# Altium project BMS028B.PrjPcb (part 2 of 3)

## Sheet BMS028B_FETs.SchDoc: FETs
size 431 x 279 mm; Date: Not shown in title block; ApprovedBy: Not shown in title block; CheckedBy: Not shown in title block; Author: Not shown in title block; CompanyName: Not shown in title block; DrawnBy: M Sunna; Engineer: Not shown in title block; Organization: Not shown in title block; Address1: Not shown in title block; Address2: Not shown in title block; Address3: Not shown in title block; Address4: Not shown in title block; DocumentNumber: 3; Revision: Use project parameter SCH_Rev; SheetNumber: 3; SheetTotal: 5; PageSetup: Record=PageOptions|CenterHorizontal=True|CenterVertical=True|PrintScale=1.00|XCorrection=1.00|YCorrection=1.00|PrintKind=0|BorderSize=5000000|LeftOffset=0|BottomOffset=0|Orientation=2|PaperLength=1000|PaperWidth=1000|Scale=100|PaperSource=15|PrintQuality=600|MediaType=1|DitherType=10|PaperKind=Letter|PrintScaleMode=1; CurrentTime: Not shown in title block; CurrentDate: Not shown in title block; Time: Not shown in title block; DocumentFullPathAndName: Not shown in title block; DocumentName: Not shown in title block; ModifiedDate: Not shown in title block; ImagePath: Not shown in title block
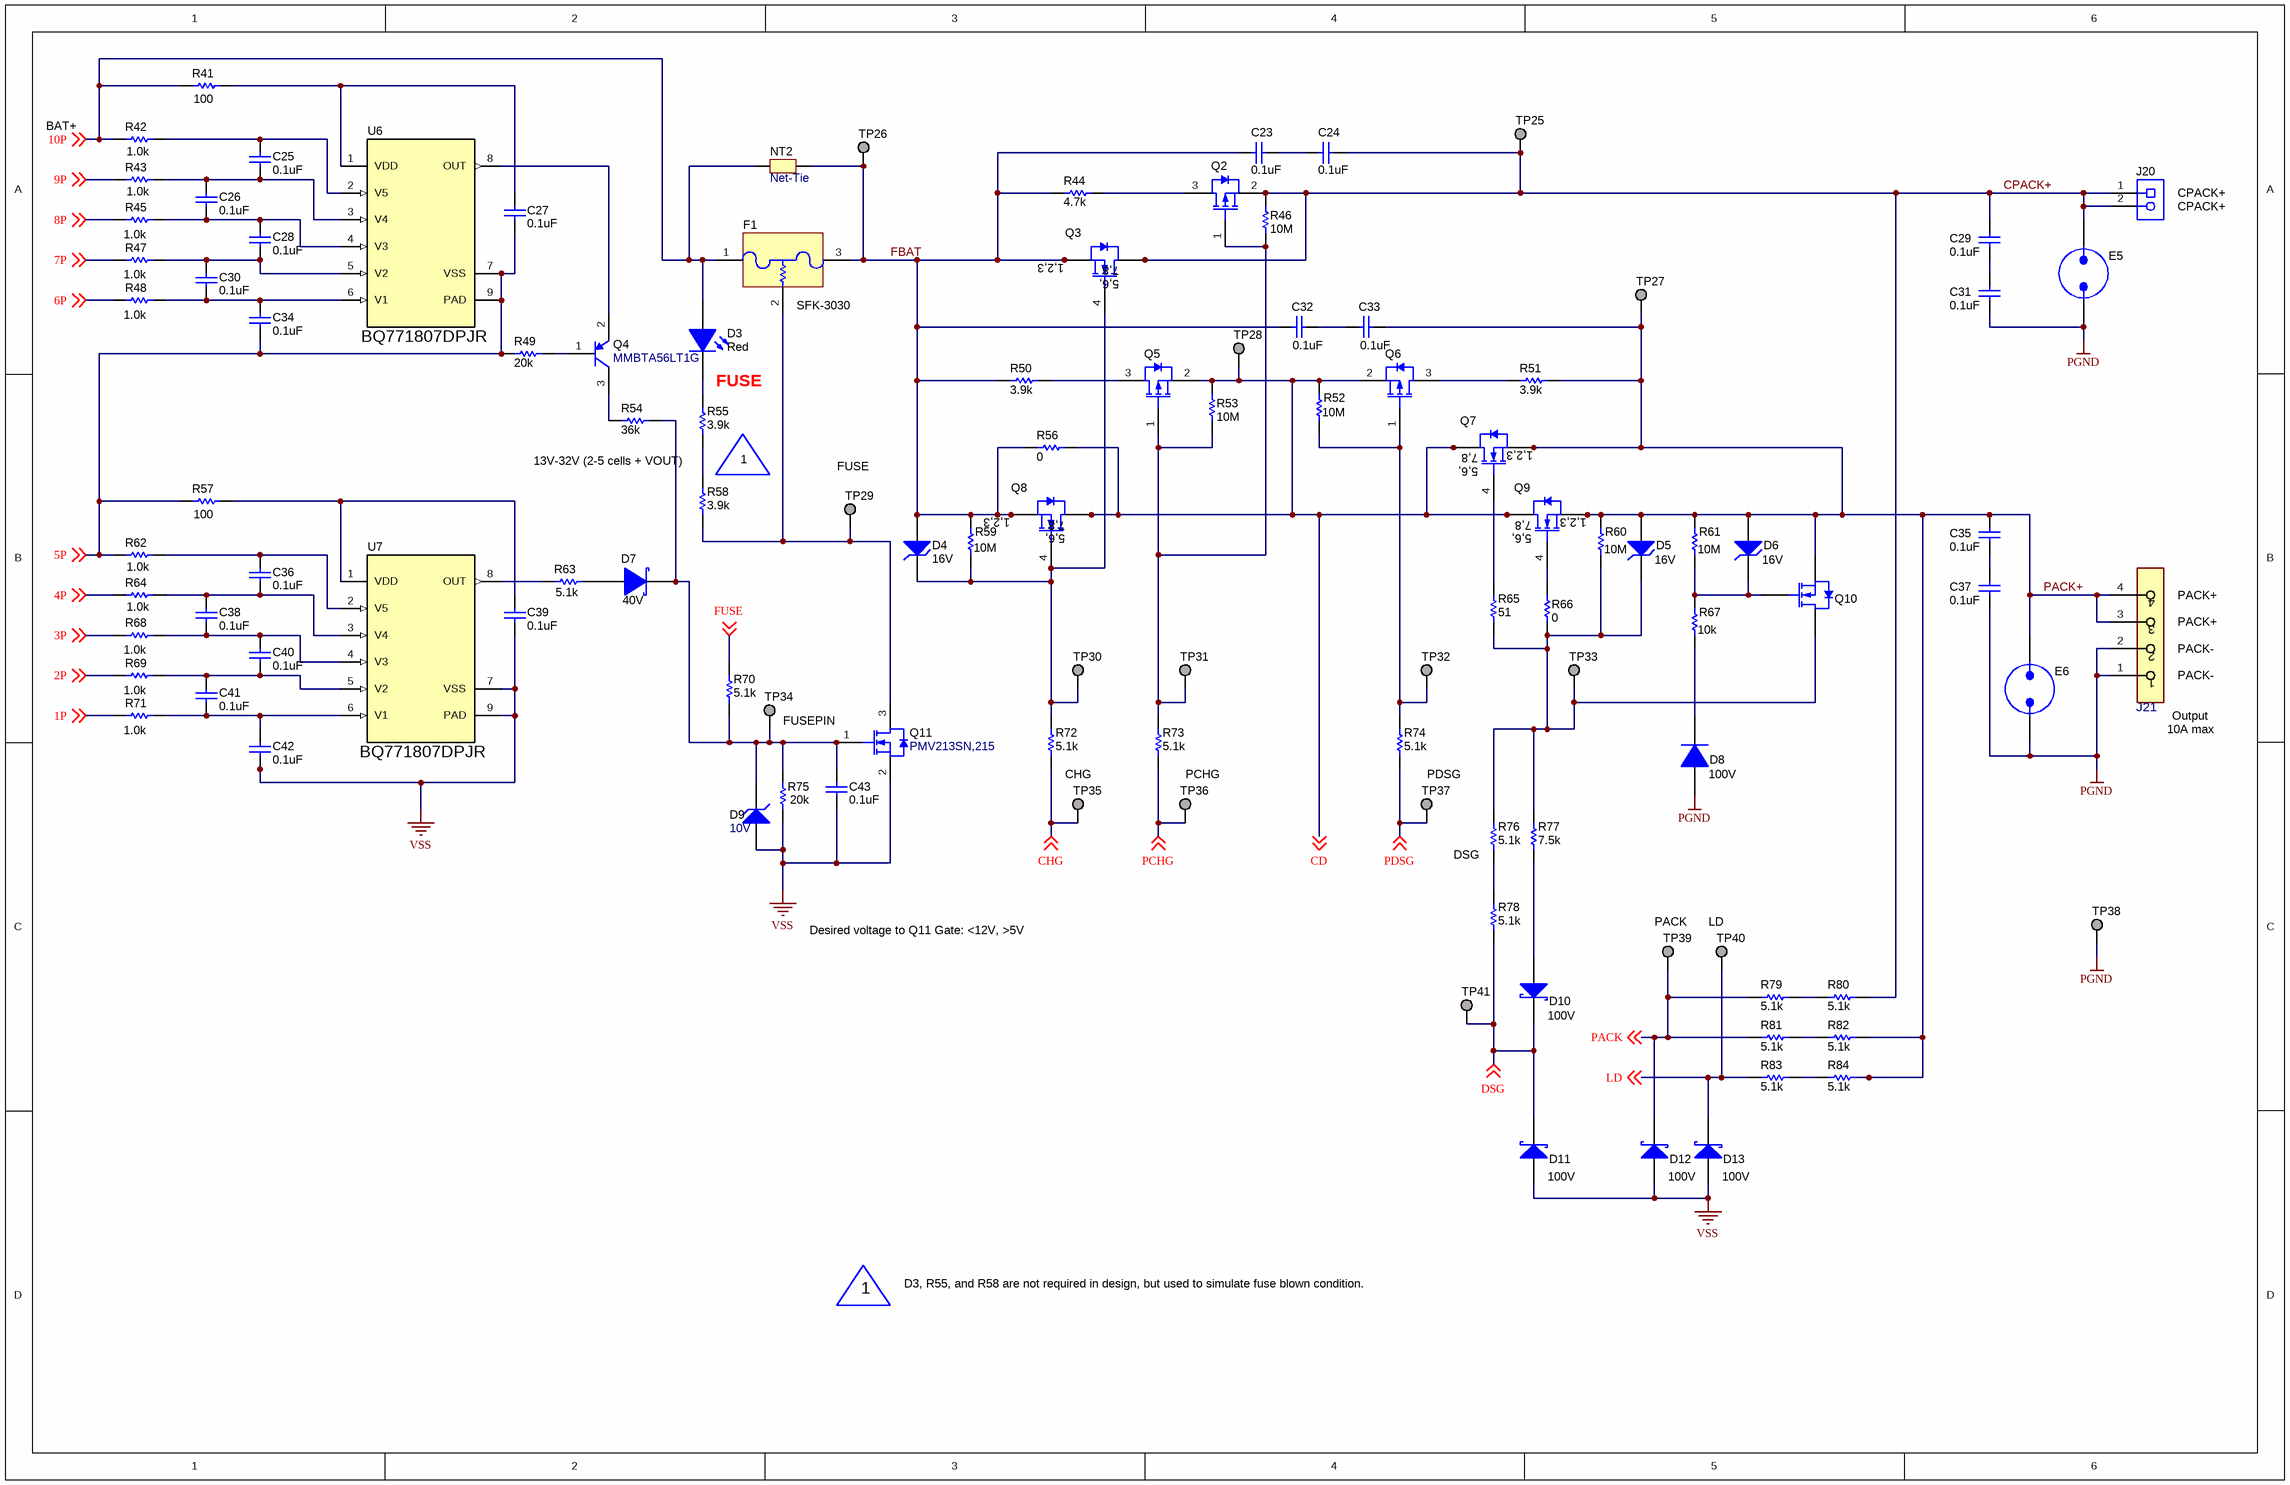
[diagram p2: BMS028B_FETs.SchDoc]

### Parts
C23  Cap_F: 0.1uF  [0603]  (hidden comment: GCJ188R72A104KA01D)
C24  Cap_F: 0.1uF  [0603]  (hidden comment: GCJ188R72A104KA01D)
C25  ValueDisplayed: 0.1uF  [0603]  (hidden comment: 885012206095)
C26  ValueDisplayed: 0.1uF  [0603]  (hidden comment: 885012206095)
C27  ValueDisplayed: 0.1uF  [0603]  (hidden comment: 885012206095)
C28  ValueDisplayed: 0.1uF  [0603]  (hidden comment: 885012206095)
C29  Cap_F: 0.1uF  [0603]  (hidden comment: GCJ188R72A104KA01D)
C30  ValueDisplayed: 0.1uF  [0603]  (hidden comment: 885012206095)
C31  Cap_F: 0.1uF  [0603]  (hidden comment: GCJ188R72A104KA01D)
C32  ValueDisplayed: 0.1uF  [0603]  (hidden comment: GCJ188R72A104KA01D)
C33  ValueDisplayed: 0.1uF  [0603]  (hidden comment: GCJ188R72A104KA01D)
C34  ValueDisplayed: 0.1uF  [0603]  (hidden comment: 885012206095)
C35  Cap_F: 0.1uF  [0603]  (hidden comment: GCJ188R72A104KA01D)
C36  ValueDisplayed: 0.1uF  [0603]  (hidden comment: 885012206095)
C37  Cap_F: 0.1uF  [0603]  (hidden comment: GCJ188R72A104KA01D)
C38  ValueDisplayed: 0.1uF  [0603]  (hidden comment: 885012206095)
C39  ValueDisplayed: 0.1uF  [0603]  (hidden comment: 885012206095)
C40  ValueDisplayed: 0.1uF  [0603]  (hidden comment: 885012206095)
C41  ValueDisplayed: 0.1uF  [0603]  (hidden comment: 885012206095)
C42  ValueDisplayed: 0.1uF  [0603]  (hidden comment: 885012206095)
C43  ValueDisplayed: 0.1uF  [0603]  (hidden comment: 885012206095)
D3  value Red  [WL-SMCW_RED]  (hidden comment: 150060RS75000)
D4  value 16V  [SOD-123]  (hidden comment: MMSZ5246B-7-F)
D5  value 16V  [SOD-123]  (hidden comment: MMSZ5246B-7-F)
D6  value 16V  [SOD-123]  (hidden comment: MMSZ5246B-7-F)
D7  value 40V  [SOT-323]  (hidden comment: BAS40W-7-F)
D8  value 100V  [SOD-123]  (hidden comment: 1N4148W-7-F)
D9  value 10V  [SOD-123]  (hidden comment: MMSZ4697T1G)
D10  Vr_V: 100V  [SOD-123]  (hidden comment: BAT46W-7-F)
D11  Vr_V: 100V  [SOD-123]  (hidden comment: BAT46W-7-F)
D12  Vr_V: 100V  [SOD-123]  (hidden comment: BAT46W-7-F)
D13  Vr_V: 100V  [SOD-123]  (hidden comment: BAT46W-7-F)
E5  Spark Gap  [SPARK_GAP2]  (value not drawn)  (no BOM)
E6  Spark Gap  [SPARK_GAP2]  (value not drawn)  (no BOM)
F1  SFK-3030  [FUSE_SFK-xx30x]
J20  ED555/2DS  [TERM_BLK_ED555-2DS]  (value not drawn)
J21  OSTTE040161  [FP-OSTTE040161_HDR4-MFG]  (value not drawn)
NT2  Net-Tie  [Net-Tie_50milWide_30milLong]  (net tie, no BOM)
Q2  ZXMP10A13FTA  [SOT-23]  (value not drawn)
Q3  CSD19534Q5A  [DQJ0008A]  (value not drawn)
Q4  MMBTA56LT1G  [SOT-23]
Q5  ZXMP10A13FTA  [SOT-23]  (value not drawn)
Q6  ZXMP10A13FTA  [SOT-23]  (value not drawn)
Q7  CSD19532Q5B  [DNK0008A]  (value not drawn)
Q8  CSD19532Q5B  [DNK0008A]  (value not drawn)
Q9  CSD19532Q5B  [DNK0008A]  (value not drawn)
Q10  MOSFET_N_D3G1S2  [SOT-323]  (value not drawn)
Q11  PMV213SN,215  [SOT-23]
R41  ValueDisplayed: 100  [0603]  (hidden comment: Resistor)
R42  ValueDisplayed: 1.0k  [0603]  (hidden comment: Resistor)
R43  ValueDisplayed: 1.0k  [0603]  (hidden comment: Resistor)
R44  ValueDisplayed: 4.7k  [2512]  (hidden comment: CRCW25124K70JNEG)
R45  ValueDisplayed: 1.0k  [0603]  (hidden comment: Resistor)
R46  ValueDisplayed: 10M  [0603]  (hidden comment: Resistor)
R47  ValueDisplayed: 1.0k  [0603]  (hidden comment: Resistor)
R48  ValueDisplayed: 1.0k  [0603]  (hidden comment: Resistor)
R49  ValueDisplayed: 20k  [0603]  (hidden comment: CRCW060320K0JNEA)
R50  ValueDisplayed: 3.9k  [2512]  (hidden comment: CRCW25123K90JNEG)
R51  ValueDisplayed: 3.9k  [2512]  (hidden comment: CRCW25123K90JNEG)
R52  ValueDisplayed: 10M  [0603]  (hidden comment: Resistor)
R53  ValueDisplayed: 10M  [0603]  (hidden comment: Resistor)
R54  ValueDisplayed: 36k  [0603]  (hidden comment: CRCW060336K0JNEA)
R55  ValueDisplayed: 3.9k  [1206]  (hidden comment: CRCW12063K90JNEA)
R56  ValueDisplayed: 0  [2512_WIDE_VISHAY]  (hidden comment: Resistor)
R57  ValueDisplayed: 100  [0603]  (hidden comment: Resistor)
R58  ValueDisplayed: 3.9k  [1206]  (hidden comment: CRCW12063K90JNEA)
R59  ValueDisplayed: 10M  [0603]  (hidden comment: Resistor)
R60  ValueDisplayed: 10M  [0603]  (hidden comment: Resistor)
R61  ValueDisplayed: 10M  [0603]  (hidden comment: Resistor)
R62  ValueDisplayed: 1.0k  [0603]  (hidden comment: Resistor)
R63  ValueDisplayed: 5.1k  [0603]  (hidden comment: Resistor)
R64  ValueDisplayed: 1.0k  [0603]  (hidden comment: Resistor)
R65  ValueDisplayed: 51  [0603]  (hidden comment: CRCW060351R0JNEA)
R66  ValueDisplayed: 0  [0603]  (hidden comment: CRCW06030000Z0EA)
R67  ValueDisplayed: 10k  [0603]  (hidden comment: Resistor)
R68  ValueDisplayed: 1.0k  [0603]  (hidden comment: Resistor)
R69  ValueDisplayed: 1.0k  [0603]  (hidden comment: Resistor)
R70  ValueDisplayed: 5.1k  [0603]  (hidden comment: Resistor)
R71  ValueDisplayed: 1.0k  [0603]  (hidden comment: Resistor)
R72  ValueDisplayed: 5.1k  [0603]  (hidden comment: CRCW06035K10JNEA)
R73  ValueDisplayed: 5.1k  [0603]  (hidden comment: CRCW06035K10JNEA)
R74  ValueDisplayed: 5.1k  [0603]  (hidden comment: CRCW06035K10JNEA)
R75  ValueDisplayed: 20k  [0603]  (hidden comment: Resistor)
R76  ValueDisplayed: 5.1k  [1206]  (hidden comment: CRCW12065K10JNEA)
R77  ValueDisplayed: 7.5k  [0603]  (hidden comment: CRCW06037K50JNEA)
R78  ValueDisplayed: 5.1k  [1206]  (hidden comment: CRCW12065K10JNEA)
R79  ValueDisplayed: 5.1k  [1206]  (hidden comment: CRCW12065K10JNEA)
R80  ValueDisplayed: 5.1k  [1206]  (hidden comment: CRCW12065K10JNEA)
R81  ValueDisplayed: 5.1k  [1206]  (hidden comment: CRCW12065K10JNEA)
R82  ValueDisplayed: 5.1k  [1206]  (hidden comment: CRCW12065K10JNEA)
R83  ValueDisplayed: 5.1k  [1206]  (hidden comment: CRCW12065K10JNEA)
R84  ValueDisplayed: 5.1k  [1206]  (hidden comment: CRCW12065K10JNEA)
TP25  TESTPOINT  [TP_VIA_060RND040]  (value not drawn)  (no BOM)
TP26  TESTPOINT  [TP_VIA_060RND040]  (value not drawn)  (no BOM)
TP27  TESTPOINT  [TP_VIA_060RND040]  (value not drawn)  (no BOM)
TP28  TESTPOINT  [TP_VIA_060RND040]  (value not drawn)  (no BOM)
TP29  TESTPOINT  [TP_VIA_060RND040]  (value not drawn)  (no BOM)
TP30  TESTPOINT  [TP_VIA_060RND040]  (value not drawn)  (no BOM)
TP31  TESTPOINT  [TP_VIA_060RND040]  (value not drawn)  (no BOM)
TP32  TESTPOINT  [TP_VIA_060RND040]  (value not drawn)  (no BOM)
TP33  TESTPOINT  [TP_VIA_060RND040]  (value not drawn)  (no BOM)
TP34  TESTPOINT  [TP_VIA_060RND040]  (value not drawn)  (no BOM)
TP35  TESTPOINT  [TP_VIA_060RND040]  (value not drawn)  (no BOM)
TP36  TESTPOINT  [TP_VIA_060RND040]  (value not drawn)  (no BOM)
TP37  TESTPOINT  [TP_VIA_060RND040]  (value not drawn)  (no BOM)
TP38  TESTPOINT  [TP_VIA_060RND040]  (value not drawn)  (no BOM)
TP39  TESTPOINT  [TP_VIA_060RND040]  (value not drawn)  (no BOM)
TP40  TESTPOINT  [TP_VIA_060RND040]  (value not drawn)  (no BOM)
TP41  TESTPOINT  [TP_VIA_060RND040]  (value not drawn)  (no BOM)
U6  BQ771807DPJR  [DPJ0008A]
U7  BQ771807DPJR  [DPJ0008A]

### Nets
PGND: C31.1 C37.1 D8.2(A) E5.2 E6.2 J21.1 J21.2 TP38.1
VSS: C39.1 C42.1 C43.1 D9.2(A) D11.2(A) D12.2(A) D13.2(A) Q11.2(S) R75.1 U7.7(VSS) U7.9(PAD)
1P: R71.1 ; off-sheet 1P
2P: R69.1 ; off-sheet 2P
3P: R68.1 ; off-sheet 3P
4P: R64.1 ; off-sheet 4P
5P: C27.1 C34.1 R49.1 R57.1 R62.1 U6.7(VSS) U6.9(PAD) ; off-sheet 5P
6P: R48.1 ; off-sheet 6P
7P: R47.1 ; off-sheet 7P
8P: R45.1 ; off-sheet 8P
9P: R43.1 ; off-sheet 9P
10P: D3.2(A) F1.1(Fuse) NT2.2 R41.1 R42.1 ; off-sheet 10P
CD: Q5.2(S) Q6.2(S) Q7.5(D) Q7.6(D) Q7.7(D) Q7.8(D) Q7.9(D) Q8.5(D) Q8.6(D) Q8.7(D) Q8.8(D) Q8.9(D) Q9.5(D) Q9.6(D) Q9.7(D) Q9.8(D) Q9.9(D) R52.1 R53.1 R56.2 TP28.1 ; off-sheet CD
CHG: R72.1 TP35.1 ; off-sheet CHG
CPACK+: C24.2 C29.2 E5.1 J20.1 J20.2 Q2.2(S) Q3.5(D) Q3.6(D) Q3.7(D) Q3.8(D) Q3.9(D) R46.1 R80.1 TP25.1
DSG: D10.1(K) D11.1(K) R78.1 TP41.1 ; off-sheet DSG
FBAT: C23.1 C32.2 D4.2(A) F1.3(Fuse) NT2.1 Q3.1(S) Q3.2(S) Q3.3(S) Q8.1(S) Q8.2(S) Q8.3(S) R44.1 R50.1 R56.1 R59.1 TP26.1
FUSE: R70.2 ; off-sheet FUSE
LD: D13.1(K) R83.2 TP40.1 ; off-sheet LD
PACK: D12.1(K) R79.2 R81.2 TP39.1 ; off-sheet PACK
PACK+: C33.1 C35.2 D5.2(A) D6.2(A) E6.1 J21.3 J21.4 Q7.1(S) Q7.2(S) Q7.3(S) Q9.1(S) Q9.2(S) Q9.3(S) Q10.2(S) R51.2 R60.1 R61.1 R82.1 R84.1 TP27.1
PCHG: R73.1 TP36.1 ; off-sheet PCHG
PDSG: R74.1 TP37.1 ; off-sheet PDSG
NetC23_2: C23.2 C24.1
NetC25_1: C25.1 C26.2 R43.2 U6.3(V4)
NetC25_2: C25.2 R42.2 U6.2(V5)
NetC26_1: C26.1 C28.2 R45.2 U6.4(V3)
NetC27_2: C27.2 R41.2 U6.1(VDD)
NetC28_1: C28.1 C30.2 R47.2 U6.5(V2)
NetC29_1: C29.1 C31.2
NetC30_1: C30.1 C34.2 R48.2 U6.6(V1)
NetC32_1: C32.1 C33.2
NetC35_1: C35.1 C37.2
NetC36_1: C36.1 C38.2 R64.2 U7.3(V4)
NetC36_2: C36.2 R62.2 U7.2(V5)
NetC38_1: C38.1 C40.2 R68.2 U7.4(V3)
NetC39_2: C39.2 R57.2 U7.1(VDD)
NetC40_1: C40.1 C41.2 R69.2 U7.5(V2)
NetC41_1: C41.1 C42.2 R71.2 U7.6(V1)
NetC43_2: C43.2 D7.3(K) D9.1(K) Q11.1(G) R54.2 R70.1 R75.2 TP34.1
NetD3_1: D3.1(K) R55.2
NetD4_1: D4.1(K) Q3.4(G) Q8.4(G) R59.2 R72.2 TP30.1
NetD5_1: D5.1(K) Q10.3(D) R60.2 R65.2 R66.2 R76.2 R77.2 TP33.1
NetD6_1: D6.1(K) Q10.1(G) R61.2 R67.1
NetD7_1: D7.1(A) R63.2
NetD8_1: D8.1(K) R67.2
NetD10_2: D10.2(A) R77.1
NetF1_2: F1.2(Heater) Q11.3(D) R58.1 TP29.1
NetQ2_1: Q2.1(G) Q5.1(G) R46.2 R53.2 R73.2 TP31.1
NetQ2_3: Q2.3(D) R44.2
NetQ4_1: Q4.1(B) R49.2
NetQ4_2: Q4.2(E) U6.8(OUT)
NetQ4_3: Q4.3(C) R54.1
NetQ5_3: Q5.3(D) R50.2
NetQ6_1: Q6.1(G) R52.2 R74.2 TP32.1
NetQ6_3: Q6.3(D) R51.1
NetQ7_4: Q7.4(G) R65.1
NetQ9_4: Q9.4(G) R66.1
NetR55_1: R55.1 R58.2
NetR63_1: R63.1 U7.8(OUT)
NetR76_1: R76.1 R78.2
NetR79_1: R79.1 R80.2
NetR81_1: R81.1 R82.2
NetR83_1: R83.1 R84.2

### Notes on the sheet
- BAT+
- (near J20) CPACK+
- FUSE
- 13V-32V (2-5 cells + VOUT)
- 1
- (near TP29) FUSE
- (near J21) PACK+
- (near J21) PACK-
- (near TP34) FUSEPIN
- (near J21) Output
- 10A max
- CHG
- PCHG
- PDSG
- (near R76) DSG
- Desired voltage to Q11 Gate: <12V, >5V
- (near TP39) PACK
- (near TP40) LD
- D3, R55, and R58 are not required in design, but used to simulate fuse blown condition.
- (in symbol CMP-0000958-3) 7,8; 1,2,3; 5,6,
- (in symbol CMP-0000962-2) 1,2,3; 7,8; 5,6,

### Library data of the parts
C23 C24 C29 C31 C35 C37 = CMP-0064935-4: CAP, CERM, 0.1 uF, 100 V,+/- 10%, X7R, AEC-Q200 Grade 1, 0603; Manufacturer: MuRata; Polarized: N; Value: 0.1uF; U/M: EA; Value1: Unknown; VDC_V: 100V; TaMin_C: -55°C; TaMax_C: 125°C; SizeArea_mm2: 1.28; SizeAreaWB_mm2: 4.68; SizeX_mm: 1.6; SizeY_mm: 0.8; SizeZ_mm: 1; AEC Category: Q200; AEC Qualified: Y; CompType: Capacitor; PartNumber: GCJ188R72A104KA01D; ValueDisplayed: 0.1uF; PackageReference: 0603; RoHS: Y; Tolerance_%: 10%; Value2: 100V; MountType: SMT; Technology: Ceramic; TempCo: X7R; Cap_Case: 0603; Published: 2008-06-19; Publisher: Texas Instruments; LatestRevisionDate: 2017-06-05; ComponentLink1Description: Datasheet link; ComponentLink1URL: http://search.murata.co.jp/Ceramy/image/img/A01X/G101/ENG/GCJ188R72A104KA01-01.pdf; Supplier 1: Digi-Key; Supplier Part Number 1: 490-13420-1-ND; Supplier 2: Mouser; Supplier Part Number 2: 81-GCJ188R72A104KA1D; AEC Grade: 1
C25-C28 C30 C34 C36 C38-C43 = CMP-0006837-4: CAP, CERM, 0.1 uF, 50 V, +/- 10%, X7R, 0603; Manufacturer: Wurth Elektronik; Polarized: N; Value: 0.1uF; U/M: EA; Cap_F: 100nF; Value1: Unknown; VDC_V: 50V; TaMin_C: -55°C; TaMax_C: 125°C; SizeArea_mm2: 1.28; SizeAreaWB_mm2: 4.68; SizeX_mm: 1.6; SizeY_mm: 0.8; SizeZ_mm: 1; AEC Category: Q200; CompType: Capacitor; PartNumber: 885012206095; PackageReference: 0603; RoHS: Y; Tolerance_%: 10%; Value2: 50V; MountType: SMT; Technology: Ceramic; TempCo: X7R; Cap_Case: 0603; Published: 2008-06-19; Publisher: Texas Instruments; LatestRevisionDate: 2017-03-09; ComponentLink1Description: Datasheet link; ComponentLink1URL: http://katalog.we-online.de/pbs/datasheet/885012206095.pdf; AEC Qualified: N; AEC Grade: N/A
C32 C33 = CMP-0064935-4: CAP, CERM, 0.1 uF, 100 V,+/- 10%, X7R, AEC-Q200 Grade 1, 0603; Manufacturer: MuRata; TaMin_C: -55°C; Polarized: N; SizeAreaWB_mm2: 4.68; Value1: Unknown; U/M: EA; Value: 0.1uF; TaMax_C: 125°C; SizeZ_mm: 1; SizeX_mm: 1.6; SizeY_mm: 0.8; Value2: 100V; SizeArea_mm2: 1.28; AEC Qualified: Y; Cap_F: 100nF; AEC Category: Q200; Supplier Part Number 2: 81-GCJ188R72A104KA1D; Publisher: Texas Instruments; Supplier 2: Mouser; TempCo: X7R; Published: 2008-06-19; RoHS: Y; MountType: SMT; Supplier 1: Digi-Key; PackageReference: 0603; Tolerance_%: 10%; Cap_Case: 0603; CompType: Capacitor; LatestRevisionDate: 2017-06-05; PartNumber: GCJ188R72A104KA01D; VDC_V: 100V; ComponentLink1Description: Datasheet link; AEC Grade: 1; Supplier Part Number 1: 490-13420-1-ND; Technology: Ceramic; ComponentLink1URL: http://search.murata.co.jp/Ceramy/image/img/A01X/G101/ENG/GCJ188R72A104KA01-01.pdf
D3 = CMP-0002947-3: LED, Red, SMD; Manufacturer: Wurth Elektronik; Type: AlInGaP; Vf_V: 2V; Io_A: 30mA; Vr_V: 5V; Tjmax_C: 85°C; Power_TotalModule: 72mW; Value1: 0.072W; Angle: 140; CompType: LED; PartNumber: 150060RS75000; MountType: SMT; RoHS: Y; PackageReference: LED_0603; Value2: 2V; Color: Red; ComponentLink1URL: http://katalog.we-online.de/led/datasheet/150060RS75000.pdf; ComponentLink1Description: Datasheet link
D4 = CMP-0005754-4: Diode, Zener, 16 V, 500 mW, SOD-123; Manufacturer: Diodes Inc.; Power_W: 500mW; SizeAreaWB_mm2: 13.095; Value1: 0.5W; RJA_CperW: 350; SizeZ_mm: 1.35; SizeX_mm: 3.85; SizeY_mm: 1.7; SizeArea_mm2: 6.545; AEC Category: Q101; Vz_V: 16V; RoHS: Y; MountType: SMT; PackageReference: SOD-123; CompType: Zener; PartNumber: MMSZ5246B-7-F; AEC Qualified: ?; ComponentLink1Description: Datasheet link; ComponentLink1URL: http://www.diodes.com/datasheets/ds18010.pdf
D5 D6 = CMP-0005754-4: Diode, Zener, 16 V, 500 mW, SOD-123; Manufacturer: Diodes Inc.; Power_W: 500mW; SizeY_mm: 1.7; Value1: 0.5W; SizeX_mm: 3.85; RJA_CperW: 350; SizeAreaWB_mm2: 13.095; SizeArea_mm2: 6.545; AEC Category: Q101; SizeZ_mm: 1.35; MountType: SMT; Vz_V: 16V; PackageReference: SOD-123; PartNumber: MMSZ5246B-7-F; AEC Qualified: ?; CompType: Zener; ComponentLink1Description: Datasheet link; RoHS: Y; ComponentLink1URL: http://www.diodes.com/datasheets/ds18010.pdf
D7 = CMP-0028438-2: Diode, Schottky, 40 V, 0.2 A, SOT-323; Manufacturer: Diodes Inc.; Value2: 0.9V; SizeArea_mm2: 4.84; Vf_V: 9dV; Value1: 0.2A; Green_Lifecycle: Not Set; SizeAreaWB_mm2: 10.24; SizeX_mm: 2.2; AEC Category: Q101; Io_A: 2dA; Green_REACh: Incomplete; SizeZ_mm: 1.1; Green_EU RoHS-2: Incomplete; PartNumber: BAS40W-7-F; RoHS: Y; CompType: Diode; ComponentLink1Description: Datasheet link; Green_EU RoHS: Incomplete; Vr_V: 40V; MountType: SMT; SizeY_mm: 2.2; Type: Schottky; ComponentLink1URL: http://www.diodes.com/datasheets/ds30114.pdf; PackageReference: SOT-323; AEC Qualified: ?
D8 = CMP-0029001-2: Diode, Ultrafast, 100 V, 0.15 A, SOD-123; Manufacturer: Diodes Inc.; Vf_V: 1.25V; Value1: 0.15A; Io_A: 1.5dA; TJmax_C: 150°C; SizeAreaWB_mm2: 13.095; SizeArea_mm2: 6.545; SizeX_mm: 3.85; SizeY_mm: 1.7; SizeZ_mm: 1.35; AEC Category: Q101; Green_Lifecycle: Active; Green_REACh: Passed; PartNumber: 1N4148W-7-F; PackageReference: SOD-123; CompType: Diode; Value2: 1.25V; Vr_V: 100V; MountType: SMT; Type: Ultrafast; RoHS: Y; ComponentLink1Description: Datasheet link; ComponentLink1URL: http://www.diodes.com/datasheets/ds30086.pdf; AEC Qualified: ?; Green_EU RoHS: Passed; Green_EU RoHS-2: Passed
D9 = CMP-0005740-3: Diode, Zener, 10 V, 500 mW, SOD-123; Manufacturer: ON Semiconductor; SizeY_mm: 1.7; SizeX_mm: 3.85; RJA_CperW: 340; SizeAreaWB_mm2: 13.095; AEC Category: Q101; Power_W: 500mW; SizeZ_mm: 1.35; Value1: 0.5W; SizeArea_mm2: 6.545; PackageReference: SOD-123; AEC Qualified: ?; MountType: SMT; RoHS: Y; ComponentLink1Description: Datasheet link; PartNumber: MMSZ4697T1G; CompType: Zener; ComponentLink1URL: http://www.onsemi.com/pub_link/Collateral/MMSZ4678T1-D.PDF; Vz_V: 10V
D10-D13 = CMP-0028450-2: Diode, Schottky, 100 V, 0.15 A, SOD-123; Manufacturer: Diodes Inc.; Value: 100V; Io_A: 150mA; SizeArea_mm2: 6.545; SizeX_mm: 3.85; Value2: 0.6V; Value1: 0.15A; AEC Category: Q101; SizeZ_mm: 1.35; SizeY_mm: 1.7; Green_Lifecycle: Active; Green_REACh: Passed; SizeAreaWB_mm2: 13.095; Vf_V: 600mV; ComponentLink1Description: Datasheet link; MountType: SMT; ComponentLink1URL: http://www.diodes.com/datasheets/ds30044.pdf; PartNumber: BAT46W-7-F; Type: Schottky; AEC Qualified: ?; Green_EU RoHS-2: Passed; Green_EU RoHS: Passed; CompType: Diode; RoHS: Y; PackageReference: SOD-123
E5 E6 = CMP-0079939-1: CompType: Spark Gap
F1 = CMP-0078325-2: Fuse, 30 A, 62 VDC, SMD; Manufacturer: Dexerials Corporation; Irating_A: 30A; VDC_V: 62V; Rtyp_Ohm: 1.75m; PartNumber: SFK-3030; PackageReference: 9.5x2x5mm; CompType: Fuse; ComponentLink1Description: Datasheet URL; MountType: SMT; ComponentLink1URL: https://sps16.itg.ti.com/sites/KMS/crossdivteams/altium/docs/ComponentDatasheets/Dexerials_SFK-xx30x.pdf; RoHS: Y
J20 = CMP-0074913-1: Terminal Block, 3.5mm Pitch, 2x1, TH; Manufacturer: On-Shore Technology; Cert_VDE: Y; CNHeader: False; Current_A: 6A; Green_Lifecycle: Active; Shrouded: N; Gender: Female; Green_REACh: Passed; Voltage_V: 150V; Row_Count: 1; Pitch_mm: 3.5; ContactFinish: Brass; CT: True; ComponentLink1URL: http://on-shore.com/sites/default/files/manuals/ed555ds.pdf; Publisher: Texas Instruments; Color: Grey; Cert_CULUS: Y; RoHS: Y; MountType: TH; Green_EU RoHS-2: Passed; Supplier 1: Digi-Key; Green_EU RoHS: Passed with Exemption; PackageReference: 7.0x8.2x6.5mm; PinCount: 2; CompType: Terminal Block; LatestRevisionDate: 2017-07-12; PartNumber: ED555/2DS; ComponentLink1Description: Datasheet URL; Supplier Part Number 1: ED1514-ND
J21 = CMP-0087048-1: TERM BLOCK 3.5MM VERT 4POS PCB; Manufacturer: On Shore Technology; Row_Count: 1; Current_A: 10A; ContactFinish: Tin; Voltage_V: 300V; PinCount: 4; Symbol Name: SYM-OSTTE040161; PartNumber: OSTTE040161; PackageReference: HDR4; ComponentLink1URL: http://www.on-shore.com/wp-content/uploads/2019/02/OSTTEXX0161.pdf; ComponentLink1Description: Datasheet; RoHS: TRUE
NT2 = CMP-0078142-3: Single point connection between nets.; MountType: SMT; PackageReference: N/A; CompType: Net-Tie; Library Reference: Net-Tie; Manufacturer: N/A; PartNumber: N/A
Q2 Q5 Q6 = CMP-0000158-3: MOSFET, P-CH, -100 V, -0.6 A, SOT-23; Manufacturer: Diodes Inc.; Alternate Manufacturer: None; Rdson45_ohm: 1; ChType: P; Value: -100V; Vgs_V: -4V; QgTyp_nC: 3.5; SizeY_mm: 3; SizeArea_mm2: 7.5; IdsMax_A: -600mA; ChMode: Enhancement; SizeZ_mm: 1.1; SizeX_mm: 2.5; Value2: 3.5 nC; SizeAreaWB_mm2: 14; AEC Category: Q101; PartNumber: ZXMP10A13FTA; VdsMax_V: -100V; PackageReference: SOT-23; ComponentLink1Description: Datasheet link; CompType: MOSFET; RoHS: Y; MountType: SMT; ComponentLink1URL: http://www.diodes.com/datasheets/ZXMP10A13F.pdf; AEC Qualified: ?
Q3 = CMP-0000962-2: MOSFET, N-CH, 100 V, 10 A, DQJ0008A (VSONP-8); Alternate Manufacturer: None; Manufacturer: Texas Instruments; SizeZ_mm: 1.1; ChType: N; Value2: 17 nC; VdsMax_V: 100V; SizeX_mm: 6; SizeAreaWB_mm2: 55.2; SizeY_mm: 4.9; Vgs_V: 20V; QgTyp_nC: 17; Value: 100V; SizeArea_mm2: 29.4; AEC Category: Q101; IdsMax_A: 10A; U/M: EA; PartNumber: CSD19534Q5A; ComponentLink1Description: Datasheet link; CompType: MOSFET; LatestRevisionNote: Added parts.; Publisher: Texas Instruments; AEC Qualified: N; Published: 2008-06-19; RoHS: Y; LatestRevisionDate: 2017-03-09; PackageReference: DQJ0008A; MountType: SMT; ComponentLink1URL: http://www.ti.com/lit/ds/symlink/csd19534q5a.pdf
Q4 = CMP-0000338-2: Transistor, PNP, 80 V, 0.5 A, SOT-23; Manufacturer: ON Semiconductor; TaMax_C: 150°C; Value1: 0.5 A; Vcesat1_V: 250mV; SizeX_mm: 2.5; SizeY_mm: 3; TaMin_C: -55°C; IcRated_A: 500mA; CompType: BJT; SizeZ_mm: 1.1; Value: 80 V; SizeArea_mm2: 7.5; NPN: 0; Vceo_V: 80V; PNP: 1; AEC Category: Q101; SizeAreaWB_mm2: 14; U/M: EA; Supplier 2: Newark; Supplier 3: Farnell; Supplier 1: Digi-Key; Supplier Part Number 1: MMBTA56LT1GOSDKR-ND; Supplier Part Number 2: 88H4784; Supplier Part Number 3: 2393622; PartNumber: MMBTA56LT1G; LatestRevisionDate: 2017-03-09; Publisher: Texas Instruments; AEC Qualified: ?; ComponentLink1Description: Datasheet link; Published: 2008-07-31; RoHS: Y; PackageReference: SOT-23; MountType: SMT; ComponentLink1URL: http://www.onsemi.com/pub_link/Collateral/MMBTA55LT1-D.PDF
Q7-Q9 = CMP-0000958-3: MOSFET, N-CH, 100 V, 17 A, DNK0008A (VSON-CLIP-8); Alternate Manufacturer: None; Manufacturer: Texas Instruments; SizeZ_mm: 1; ChType: N; Value2: 48 nC; VdsMax_V: 100V; SizeX_mm: 6; SizeY_mm: 5; Vgs_V: 20V; QgTyp_nC: 48; Value: 100V; SizeArea_mm2: 30; AEC Category: Q101; IdsMax_A: 17A; SizeAreaWB_mm2: 56; U/M: EA; Supplier 2: Farnell; Supplier 1: Digi-Key; Supplier Part Number 1: 296-37478-6-ND; Supplier Part Number 2: 2413268; PartNumber: CSD19532Q5B; ComponentLink1Description: Datasheet link; CompType: MOSFET; AEC Qualified: N; RoHS: Y; PackageReference: DNK0008A; MountType: SMT; ComponentLink1URL: http://www.ti.com/lit/ds/symlink/csd19532q5b.pdf
Q10 = CMP-0000774-1: MOSFET, N-CH, 60 V, 0.31 A, SOT-323; PartNumber: 2N7002KW; Manufacturer: Fairchild Semiconductor; Alternate Manufacturer: None; Value: 60V; U/M: EA; ChType: N; Value1: 1; Rdson45_ohm: 1.6; Vgs_V: 2.1V; IdsMax_A: 3.1dA; SizeAreaWB_mm2: 10.24; SizeArea_mm2: 4.84; SizeX_mm: 2.2; SizeZ_mm: 1.1; AEC Category: Q101; Green_Lifecycle: Active; Green_REACh: Passed; SymbolVersion: 2008-07-28; CompType: MOSFET; PackageReference: SOT-323; VdsMax_V: 60V; RoHS: Y; MountType: SMT; Published: 2008-06-19; Publisher: Texas Instruments; LatestRevisionDate: 2017-03-09; LatestRevisionNote: Added parts.; ComponentLink1Description: Datasheet link; ComponentLink1URL: http://www.fairchildsemi.com/ds/2N/2N7002KW.pdf; Supplier 1: Digi-Key; Supplier Part Number 1: 2N7002KWCT-ND; Supplier 2: Mouser; Supplier Part Number 2: 512-2N7002KW; SizeY_mm: 2.2; AEC Qualified: ?; Green_EU RoHS: Passed; Green_EU RoHS-2: Passed
Q11 = CMP-0001015-3: MOSFET, N-CH, 100 V, 1.9 A, SOT-23; Alternate Manufacturer: None; Manufacturer: Nexperia; SizeZ_mm: 1.1; ChType: N; Value2: 7 nC; VdsMax_V: 100V; SizeX_mm: 2.5; SizeY_mm: 3; Vgs_V: 30V; QgTyp_nC: 7; Value: 100V; SizeArea_mm2: 7.5; AEC Category: Q101; IdsMax_A: 1.9A; SizeAreaWB_mm2: 14; Supplier 2: Mouser; Supplier 1: Digi-Key; Supplier Part Number 1: 568-8112-1-ND; Supplier Part Number 2: 771-PMV213SN215; PartNumber: PMV213SN,215; ComponentLink1Description: Datasheet link; CompType: MOSFET; AEC Qualified: N; RoHS: Y; PackageReference: SOT-23; MountType: SMT; ComponentLink1URL: http://www.nexperia.com/documents/data_sheet/PMV213SN.pdf
R41 R57 = CMP-0025700-4: RES, 100, 5%, 0.1 W, AEC-Q200 Grade 0, 0603; PartNumber: CRCW0603100RJNEA; Manufacturer: Vishay-Dale; Value: 100; Value_Code: 100R; Power_W: 100mW; Value2: 0.1W; VDC_V: 75V; TempCo: 200 ppm/C; EIA_Code: E24; U/M: EA; SizeArea_mm2: 1.28; SizeX_mm: 1.6; SizeY_mm: 0.8; SizeZ_mm: 1; AEC Category: Q200; AEC Qualified: Y; AEC Grade: 0; CompType: Resistor; SymbolVersion: 2009-05-29; PackageReference: 0603; RoHS: E; Res_ohm: 100; Tolerance_%: 5%; Value1: 5%; MountType: SMT; Technology: Thick Film; Published: 2008-06-26; Publisher: Texas Instruments; LatestRevisionDate: 2017-06-13; ComponentLink1Description: Datasheet link; ComponentLink1URL: http://www.vishay.com/docs/20035/dcrcwe3.pdf; Supplier 1: Digi-Key; Supplier Part Number 1: 541-100GCT-ND; Supplier 2: Newark; Supplier Part Number 2: 59M6764; Supplier 3: Mouser; Supplier Part Number 3: 71-CRCW0603J-100-E3
R42 R43 R45 R47 R48 R62 R64 R68 R69 R71 = CMP-0025729-4: RES, 1.0 k, 5%, 0.1 W, AEC-Q200 Grade 0, 0603; PartNumber: CRCW06031K00JNEA; Manufacturer: Vishay-Dale; Value: 1.0k; Res_ohm: 1k; Value_Code: 1k00; Power_W: 100mW; Value2: 0.1W; VDC_V: 75V; TempCo: 200 ppm/C; EIA_Code: E24; U/M: EA; SizeArea_mm2: 1.28; SizeX_mm: 1.6; SizeY_mm: 0.8; SizeZ_mm: 1; AEC Category: Q200; AEC Qualified: Y; AEC Grade: 0; CompType: Resistor; SymbolVersion: 2009-05-29; PackageReference: 0603; RoHS: E; Tolerance_%: 5%; Value1: 5%; MountType: SMT; Technology: Thick Film; Published: 2008-06-26; Publisher: Texas Instruments; LatestRevisionDate: 2017-06-13; ComponentLink1Description: Datasheet link; ComponentLink1URL: http://www.vishay.com/docs/20035/dcrcwe3.pdf; Supplier 1: Digi-Key; Supplier Part Number 1: 541-1.0KGCT-ND; Supplier 2: Newark; Supplier Part Number 2: 59M6750; Supplier 3: Mouser; Supplier Part Number 3: 71-CRCW0603J-1.0K-E3
R44 = CMP-0015972-3: RES, 4.7 k, 5%, 1 W, AEC-Q200 Grade 0, 2512; Manufacturer: Vishay-Dale; Power_W: 1W; TempCo: 200 ppm/C; Value_Code: 4k70; Value: 4.7k; EIA_Code: E24; SizeX_mm: 6.3; SizeY_mm: 3.2; SizeZ_mm: 0.71; SizeArea_mm2: 20.16; AEC Qualified: Y; VDC_V: 500V; AEC Grade: 0; AEC Category: Q200; RoHS: E; Value1: 5%; MountType: SMT; Supplier 1: Digi-Key; PackageReference: 2512; Tolerance_%: 5%; Res_ohm: 4.7k; Value2: 1W; CompType: Resistor; PartNumber: CRCW25124K70JNEG; ComponentLink1Description: Datasheet link; Supplier Part Number 1: 541-4.7KXCT-ND; Technology: Thick Film; ComponentLink1URL: http://www.vishay.com/docs/20035/dcrcwe3.pdf
R46 R52 R53 R59-R61 = CMP-0025702-4: RES, 10 M, 5%, 0.1 W, AEC-Q200 Grade 0, 0603; PartNumber: CRCW060310M0JNEA; Manufacturer: Vishay-Dale; Value: 10Meg; Value_Code: 10M0; Power_W: 100mW; Value2: 0.1W; VDC_V: 75V; TempCo: 200 ppm/C; EIA_Code: E24; U/M: EA; SizeArea_mm2: 1.28; SizeX_mm: 1.6; SizeY_mm: 0.8; SizeZ_mm: 1; AEC Category: Q200; AEC Qualified: Y; AEC Grade: 0; CompType: Resistor; SymbolVersion: 2009-05-29; PackageReference: 0603; RoHS: E; Res_ohm: 10M; Tolerance_%: 5%; Value1: 5%; MountType: SMT; Technology: Thick Film; Published: 2008-06-26; Publisher: Texas Instruments; LatestRevisionDate: 2017-06-13; ComponentLink1Description: Datasheet link; ComponentLink1URL: http://www.vishay.com/docs/20035/dcrcwe3.pdf; Supplier 1: Digi-Key; Supplier Part Number 1: 541-10MGCT-ND; Supplier 2: Newark; Supplier Part Number 2: 59M6761; Supplier 3: Mouser; Supplier Part Number 3: 71-CRCW0603J-10M-E3
R49 = CMP-0025753-4: RES, 20 k, 5%, 0.1 W, AEC-Q200 Grade 0, 0603; Manufacturer: Vishay-Dale; Value: 20k; Value_Code: 20k0; Power_W: 100mW; Value2: 0.1W; VDC_V: 75V; TempCo: 200 ppm/C; EIA_Code: E24; SizeArea_mm2: 1.28; SizeX_mm: 1.6; SizeY_mm: 0.8; SizeZ_mm: 1; AEC Category: Q200; AEC Qualified: Y; AEC Grade: 0; CompType: Resistor; PartNumber: CRCW060320K0JNEA; PackageReference: 0603; RoHS: E; Res_ohm: 20k; Tolerance_%: 5%; Value1: 5%; MountType: SMT; Technology: Thick Film; ComponentLink1Description: Datasheet link; ComponentLink1URL: http://www.vishay.com/docs/20035/dcrcwe3.pdf; Supplier 1: Digi-Key; Supplier Part Number 1: 541-20KGCT-ND; Supplier 2: Newark; Supplier Part Number 2: 59M6783; Supplier 3: Mouser; Supplier Part Number 3: 71-CRCW0603J-20K-E3
R50 R51 = CMP-0015958-3: RES, 3.9 k, 5%, 1 W, AEC-Q200 Grade 0, 2512; Manufacturer: Vishay-Dale; Power_W: 1W; TempCo: 200 ppm/C; Value_Code: 3k90; Value: 3.9k; EIA_Code: E24; SizeX_mm: 6.3; SizeY_mm: 3.2; SizeZ_mm: 0.71; SizeArea_mm2: 20.16; AEC Qualified: Y; VDC_V: 500V; AEC Grade: 0; AEC Category: Q200; RoHS: E; Value1: 5%; MountType: SMT; Supplier 1: Digi-Key; PackageReference: 2512; Tolerance_%: 5%; Res_ohm: 3.9k; Value2: 1W; CompType: Resistor; PartNumber: CRCW25123K90JNEG; ComponentLink1Description: Datasheet link; Supplier Part Number 1: 541-3.9KXCT-ND; Technology: Thick Film; ComponentLink1URL: http://www.vishay.com/docs/20035/dcrcwe3.pdf
R54 = CMP-0025790-4: RES, 36 k, 5%, 0.1 W, AEC-Q200 Grade 0, 0603; Manufacturer: Vishay-Dale; Power_W: 100mW; TempCo: 200 ppm/C; Value_Code: 36k0; Value: 36k; EIA_Code: E24; SizeX_mm: 1.6; SizeY_mm: 0.8; SizeZ_mm: 1; Value2: 0.1W; SizeArea_mm2: 1.28; AEC Qualified: Y; VDC_V: 75V; AEC Category: Q200; AEC Grade: 0; Supplier Part Number 2: 59M6806; Supplier 2: Newark; Supplier Part Number 3: 71-CRCW0603J-36K-E3; Supplier 3: Mouser; RoHS: E; Value1: 5%; MountType: SMT; Supplier 1: Digi-Key; PackageReference: 0603; Tolerance_%: 5%; Res_ohm: 36k; PartNumber: CRCW060336K0JNEA; ComponentLink1Description: Datasheet link; Supplier Part Number 1: 541-36KGCT-ND; Technology: Thick Film; CompType: Resistor; ComponentLink1URL: http://www.vishay.com/docs/20035/dcrcwe3.pdf
R55 R58 = CMP-0018671-3: RES, 3.9 k, 5%, 0.25 W, AEC-Q200 Grade 0, 1206; Manufacturer: Vishay-Dale; Power_W: 250mW; TempCo: 200 ppm/C; Value_Code: 3k90; Value: 3.9k; EIA_Code: E24; SizeX_mm: 3.2; SizeY_mm: 1.6; SizeZ_mm: 1.35; Value2: 0.25W; SizeArea_mm2: 5.12; AEC Qualified: Y; VDC_V: 200V; AEC Category: Q200; AEC Grade: 0; Supplier Part Number 2: 89M6870; Supplier 2: Newark; Supplier Part Number 3: 71-CRCW1206J-3.9K-E3; Supplier 3: Mouser; RoHS: E; Value1: 5%; MountType: SMT; Supplier 1: Digi-Key; PackageReference: 1206; Tolerance_%: 5%; Res_ohm: 3.9k; CompType: Resistor; PartNumber: CRCW12063K90JNEA; ComponentLink1Description: Datasheet link; Supplier Part Number 1: 541-3.9KECT-ND; Technology: Thick Film; ComponentLink1URL: http://www.vishay.com/docs/20035/dcrcwe3.pdf
R56 = CMP-0015368-2: RES, 0, 5%, 2 W, 2512 WIDE; PartNumber: RCL12250000Z0EG; Manufacturer: Vishay Draloric; Value: 0; Value_Code: 0000; Power_W: 2W; TempCo: ppm/C; EIA_Code: E24; U/M: EA; AEC Category: Q200; Green_Lifecycle: Active; Green_REACh: Passed; CompType: Resistor; SymbolVersion: 2009-05-29; PackageReference: 2512 WIDE; RoHS: Y; Res_ohm: 0; Tolerance_%: 5%; Value1: 5%; Value2: 2W; MountType: SMT; Technology: Thick Film; Published: 2008-06-26; Publisher: Texas Instruments; LatestRevisionDate: 2017-03-09; ComponentLink1Description: Datasheet link; ComponentLink1URL: http://www.vishay.com/docs/20046/rcle3.pdf; Supplier 1: Digi-Key; Supplier Part Number 1: RCL0.0ECT-ND; Supplier 2: Mouser; Supplier Part Number 2: 71-RCL12250000Z0EG; AEC Qualified: ?; Green_EU RoHS: Passed with Exemption; Green_EU RoHS-2: Incomplete
R63 R70 = CMP-0025830-4: RES, 5.1 k, 5%, 0.1 W, AEC-Q200 Grade 0, 0603; PartNumber: CRCW06035K10JNEA; Manufacturer: Vishay-Dale; Value: 5.1k; Value_Code: 5k10; Power_W: 100mW; Value2: 0.1W; VDC_V: 75V; TempCo: 200 ppm/C; EIA_Code: E24; U/M: EA; SizeArea_mm2: 1.28; SizeX_mm: 1.6; SizeY_mm: 0.8; SizeZ_mm: 1; AEC Category: Q200; AEC Qualified: Y; AEC Grade: 0; CompType: Resistor; SymbolVersion: 2009-05-29; PackageReference: 0603; RoHS: E; Res_ohm: 5.1k; Tolerance_%: 5%; Value1: 5%; MountType: SMT; Technology: Thick Film; Published: 2008-06-26; Publisher: Texas Instruments; LatestRevisionDate: 2017-06-13; ComponentLink1Description: Datasheet link; ComponentLink1URL: http://www.vishay.com/docs/20035/dcrcwe3.pdf; Supplier 1: Digi-Key; Supplier Part Number 1: 541-5.1KGCT-ND; Supplier 2: Newark; Supplier Part Number 2: 89M6773; Supplier 3: Farnell; Supplier Part Number 3: 1570751
R65 = CMP-0025825-4: RES, 51, 5%, 0.1 W, AEC-Q200 Grade 0, 0603; Manufacturer: Vishay-Dale; Value: 51; Value_Code: 51R0; Power_W: 100mW; Value2: 0.1W; VDC_V: 75V; TempCo: 200 ppm/C; EIA_Code: E24; SizeArea_mm2: 1.28; SizeX_mm: 1.6; SizeY_mm: 0.8; SizeZ_mm: 1; AEC Category: Q200; AEC Qualified: Y; AEC Grade: 0; CompType: Resistor; PartNumber: CRCW060351R0JNEA; PackageReference: 0603; RoHS: E; Res_ohm: 51; Tolerance_%: 5%; Value1: 5%; MountType: SMT; Technology: Thick Film; ComponentLink1Description: Datasheet link; ComponentLink1URL: http://www.vishay.com/docs/20035/dcrcwe3.pdf; Supplier 1: Digi-Key; Supplier Part Number 1: 541-51GCT-ND; Supplier 2: Newark; Supplier Part Number 2: 59M6822; Supplier 3: Mouser; Supplier Part Number 3: 71-CRCW0603J-51-E3
R66 = CMP-0025697-4: RES, 0, 5%, 0.1 W, AEC-Q200 Grade 0, 0603; Manufacturer: Vishay-Dale; Value: 0; Value_Code: 0000; Power_W: 100mW; Value2: 0.1W; VDC_V: 75V; TempCo: 200 ppm/C; EIA_Code: E24; SizeArea_mm2: 1.28; SizeX_mm: 1.6; SizeY_mm: 0.8; SizeZ_mm: 1; AEC Category: Q200; AEC Qualified: Y; CompType: Resistor; PartNumber: CRCW06030000Z0EA; PackageReference: 0603; RoHS: E; Res_ohm: 0; Tolerance_%: 5%; Value1: 5%; MountType: SMT; Technology: Thick Film; ComponentLink1Description: Datasheet link; ComponentLink1URL: http://www.vishay.com/docs/20035/dcrcwe3.pdf; Supplier 1: Digi-Key; Supplier Part Number 1: 541-0.0GCT-ND; Supplier 2: Newark; Supplier Part Number 2: 52K8014; Supplier 3: Mouser; Supplier Part Number 3: 71-CRCW0603-0-E3; AEC Grade: 0
R67 = CMP-0025701-4: RES, 10 k, 5%, 0.1 W, AEC-Q200 Grade 0, 0603; PartNumber: CRCW060310K0JNEA; Manufacturer: Vishay-Dale; Value: 10k; Value_Code: 10k0; Power_W: 100mW; Value2: 0.1W; VDC_V: 75V; TempCo: 200 ppm/C; EIA_Code: E24; U/M: EA; SizeArea_mm2: 1.28; SizeX_mm: 1.6; SizeY_mm: 0.8; SizeZ_mm: 1; AEC Category: Q200; AEC Qualified: Y; AEC Grade: 0; CompType: Resistor; SymbolVersion: 2009-05-29; PackageReference: 0603; RoHS: E; Res_ohm: 10k; Tolerance_%: 5%; Value1: 5%; MountType: SMT; Technology: Thick Film; Published: 2008-06-26; Publisher: Texas Instruments; LatestRevisionDate: 2017-06-13; ComponentLink1Description: Datasheet link; ComponentLink1URL: http://www.vishay.com/docs/20035/dcrcwe3.pdf; Supplier 1: Digi-Key; Supplier Part Number 1: 541-10KGCT-ND; Supplier 2: Newark; Supplier Part Number 2: 52K8066; Supplier 3: Mouser; Supplier Part Number 3: 71-CRCW0603J-10K-E3
R72 R73 = CMP-0025830-4: RES, 5.1 k, 5%, 0.1 W, AEC-Q200 Grade 0, 0603; Manufacturer: Vishay-Dale; Value: 5.1k; Value_Code: 5k10; Power_W: 100mW; Value2: 0.1W; VDC_V: 75V; TempCo: 200 ppm/C; SizeArea_mm2: 1.28; SizeX_mm: 1.6; SizeY_mm: 0.8; SizeZ_mm: 1; EIA_Code: E24; AEC Category: Q200; AEC Qualified: Y; AEC Grade: 0; CompType: Resistor; PartNumber: CRCW06035K10JNEA; PackageReference: 0603; RoHS: E; Res_ohm: 5.1k; Tolerance_%: 5%; Value1: 5%; MountType: SMT; Technology: Thick Film; ComponentLink1Description: Datasheet link; ComponentLink1URL: http://www.vishay.com/docs/20035/dcrcwe3.pdf; Supplier 1: Digi-Key; Supplier Part Number 1: 541-5.1KGCT-ND; Supplier 2: Newark; Supplier Part Number 2: 89M6773; Supplier 3: Farnell; Supplier Part Number 3: 1570751
R74 = CMP-0025830-4: RES, 5.1 k, 5%, 0.1 W, AEC-Q200 Grade 0, 0603; Manufacturer: Vishay-Dale; Value: 5.1k; Value_Code: 5k10; Power_W: 100mW; Value2: 0.1W; VDC_V: 75V; TempCo: 200 ppm/C; EIA_Code: E24; SizeArea_mm2: 1.28; SizeX_mm: 1.6; SizeY_mm: 0.8; SizeZ_mm: 1; AEC Category: Q200; AEC Qualified: Y; AEC Grade: 0; CompType: Resistor; PartNumber: CRCW06035K10JNEA; PackageReference: 0603; RoHS: E; Res_ohm: 5.1k; Tolerance_%: 5%; Value1: 5%; MountType: SMT; Technology: Thick Film; ComponentLink1Description: Datasheet link; ComponentLink1URL: http://www.vishay.com/docs/20035/dcrcwe3.pdf; Supplier 1: Digi-Key; Supplier Part Number 1: 541-5.1KGCT-ND; Supplier 2: Newark; Supplier Part Number 2: 89M6773; Supplier 3: Farnell; Supplier Part Number 3: 1570751
R75 = CMP-0025753-4: RES, 20 k, 5%, 0.1 W, AEC-Q200 Grade 0, 0603; PartNumber: CRCW060320K0JNEA; Manufacturer: Vishay-Dale; Value: 20k; Value_Code: 20k0; Power_W: 100mW; Value2: 0.1W; VDC_V: 75V; TempCo: 200 ppm/C; EIA_Code: E24; U/M: EA; SizeArea_mm2: 1.28; SizeX_mm: 1.6; SizeY_mm: 0.8; SizeZ_mm: 1; AEC Category: Q200; AEC Qualified: Y; AEC Grade: 0; CompType: Resistor; SymbolVersion: 2009-05-29; PackageReference: 0603; RoHS: E; Res_ohm: 20k; Tolerance_%: 5%; Value1: 5%; MountType: SMT; Technology: Thick Film; Published: 2008-06-26; Publisher: Texas Instruments; LatestRevisionDate: 2017-06-13; ComponentLink1Description: Datasheet link; ComponentLink1URL: http://www.vishay.com/docs/20035/dcrcwe3.pdf; Supplier 1: Digi-Key; Supplier Part Number 1: 541-20KGCT-ND; Supplier 2: Newark; Supplier Part Number 2: 59M6783; Supplier 3: Mouser; Supplier Part Number 3: 71-CRCW0603J-20K-E3
R76 R78-R84 = CMP-0018703-3: RES, 5.1 k, 5%, 0.25 W, AEC-Q200 Grade 0, 1206; Manufacturer: Vishay-Dale; Value: 5.1k; Value_Code: 5k10; Power_W: 250mW; Value2: 0.25W; VDC_V: 200V; TempCo: 200 ppm/C; SizeArea_mm2: 5.12; SizeX_mm: 3.2; SizeY_mm: 1.6; SizeZ_mm: 1.35; EIA_Code: E24; AEC Category: Q200; AEC Qualified: Y; AEC Grade: 0; CompType: Resistor; PartNumber: CRCW12065K10JNEA; PackageReference: 1206; RoHS: E; Res_ohm: 5.1k; Tolerance_%: 5%; Value1: 5%; MountType: SMT; Technology: Thick Film; ComponentLink1Description: Datasheet link; ComponentLink1URL: http://www.vishay.com/docs/20035/dcrcwe3.pdf; Supplier 1: Digi-Key; Supplier Part Number 1: 541-5.1KECT-ND; Supplier 2: Newark; Supplier Part Number 2: 59M8589; Supplier 3: Mouser; Supplier Part Number 3: 71-CRCW1206J-5.1K-E3
R77 = CMP-0025855-4: RES, 7.5 k, 5%, 0.1 W, AEC-Q200 Grade 0, 0603; Manufacturer: Vishay-Dale; Power_W: 100mW; TempCo: 200 ppm/C; Value_Code: 7k50; Value: 7.5k; EIA_Code: E24; SizeX_mm: 1.6; SizeY_mm: 0.8; SizeZ_mm: 1; Value2: 0.1W; SizeArea_mm2: 1.28; AEC Qualified: Y; VDC_V: 75V; AEC Category: Q200; AEC Grade: 0; Supplier Part Number 2: 59M6832; Supplier 2: Newark; Supplier Part Number 3: 71-CRCW0603J-7.5K-E3; Supplier 3: Mouser; RoHS: E; Value1: 5%; MountType: SMT; Supplier 1: Digi-Key; PackageReference: 0603; Tolerance_%: 5%; Res_ohm: 7.5k; CompType: Resistor; PartNumber: CRCW06037K50JNEA; ComponentLink1Description: Datasheet link; Supplier Part Number 1: 541-7.5KGCT-ND; Technology: Thick Film; ComponentLink1URL: http://www.vishay.com/docs/20035/dcrcwe3.pdf
TP25-TP41 = CMP-0078143-2: TEST POINT.  No entry in BOM.; CompType: Testpoint; PackageReference: N/A; Library Reference: TESTPOINT; Manufacturer: N/A; PartNumber: N/A
U6 U7 = CMP-0078902-2: Family 2-5S Overvoltage Protector with Internal Delay Timer, DPJ0008A (WSON-8); Alternate PartNumber: BQ771807DPJT; Alternate Manufacturer: Texas Instruments; SizeAreaWB_mm2: 20; SizeZ_mm: 0.8; SizeX_mm: 4; SizeY_mm: 3; SizeArea_mm2: 12; CompType: IC; AEC Qualified: N; AEC Category: Q200; ComponentLink1URL: http://www.ti.com/lit/ds/symlink/bq7718.pdf; PackageDescription: WSON-8; RoHS: Y; MountType: SMT; ComponentLink2URL: http://www.ti.com/product/bq7718; ComponentLink2Description: Product Folder; Manufacturer: Texas Instruments; PackageReference: DPJ0008A; PartNumber: BQ771807DPJR; ComponentLink1Description: Datasheet Link